# Altium schematic sheet CurrentSensor.SchDoc
size A; SheetNumber: 1; SheetTotal: 1
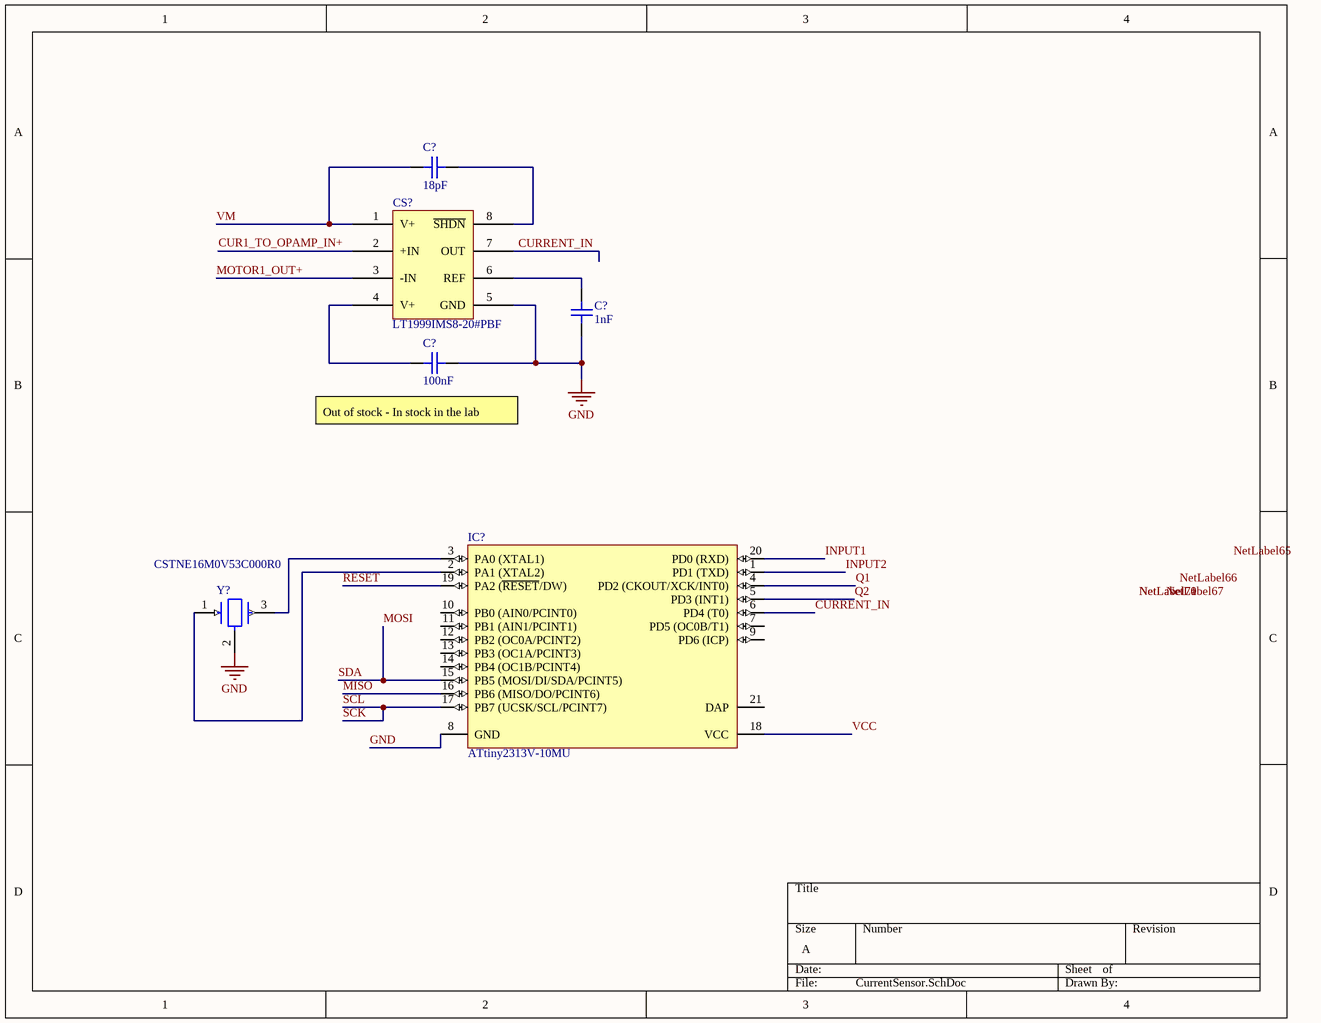
[diagram p0: CurrentSensor.SchDoc]

## Parts
(Parts that share a designator on the sheet are numbered #1, #2 ... from top to bottom, then left to right.)
C?#1  18pF  [CAP_ADJ_0805]
C?#2  1nF  [CAP_ADJ_0805]
C?#3  100nF  [CAP_ADJ_0805]
CS?  LT1999IMS8-20#PBF  [LT1999IMS8-20#PBF-ND]
IC?  ATtiny2313V-10MU  [20M1_M]
Y?  CSTNE16M0V53C000R0  [FP-CSTNE16M0V53C000R0-MFG]

## Nets
GND: C?#2.1 C?#3.1 CS?.5(GND) IC?.8(GND) Y?.2(GND)
CUR1_TO_OPAMP_IN+: CS?.2(+IN)
CURRENT_IN: CS?.7(OUT) IC?.6(PD4_(T0))
INPUT1: IC?.20(PD0_(RXD))
INPUT2: IC?.1(PD1_(TXD))
MISO: IC?.16(PB6_(MISO/DO/PCINT6))
MOSI: IC?.15(PB5_(MOSI/DI/SDA/PCINT5))  [also labelled SDA]
MOTOR1_OUT+: CS?.3(-IN)
Q1: IC?.4(PD2_(CKOUT/XCK/INT0))
Q2: IC?.5(PD3_(INT1))
RESET: IC?.19(PA2_(~{RESET}/DW))
SCK: IC?.17(PB7_(UCSK/SCL/PCINT7))  [also labelled SCL]
VCC: IC?.18(VCC)
VM: C?#1.2 CS?.1(V+)
NetC?#1_1: C?#1.1 CS?.8(~{SHDN})
NetC?#2_2: C?#2.2 CS?.6(REF)
NetC?#3_2: C?#3.2 CS?.4(V+)
NetIC?_2: IC?.2(PA1_(XTAL2)) Y?.1(Input)
NetIC?_3: IC?.3(PA0_(XTAL1)) Y?.3(Output)

Not connected (* = marked no-connect by the designer): IC? 7(PD5_(OC0B/T1)) 9(PD6_(ICP)) 10(PB0_(AIN0/PCINT0)) 11(PB1_(AIN1/PCINT1)) 12(PB2_(OC0A/PCINT2)) 13(PB3_(OC1A/PCINT3)) 14(PB4_(OC1B/PCINT4)) 21(DAP)

## Notes on the sheet
- (near C?#3) Out of stock - In stock in the lab
- Labels drawn without touching a wire or pin: NetLabel65, NetLabel66, NetLabel67

## Library data of the parts
C?#1 = CAP_ADJ_0805: CERAMIC CAPACITOR SMD 0805; Manufacturer: Yageo; Manufacturer Part Number: CC0805FRNPO9BN180; Tolerance: 1%; Voltage Rating (DC): 50V; Dielectric: C0G; Supplier 1: Digi-Key; Supplier Part Number 1: 311-4168-1-ND; Stock 1: 0; Pricing 1: 1=0.24, 10=0.172, 100=0.0808, 500=0.0566, 1000=0.0469 (USD); Mount: Surface Mount; Case/Package: 0805; Weight: 0.000194oz; Case Code (Imperial): 0805; Case Code (Metric): 2012; Min Operating Temperature: -55°C; Max Operating Temperature: 125°C; Capacitance: 18pF; Packaging: Tape and Reel; Voltage Rating: 50V; Termination: SMD/SMT; Composition: Ceramic; Length: 2mm; Height: 0.6mm; Width: 0.049inch; Thickness: 0.028inch; Depth: 1.25mm; Radiation Hardening: No; Lead Free: Lead Free; ComponentLink1URL: https://datasheet.ciiva.com/17436/upy-gp-np0-16v-to-50v-8-17436806.pdf; ComponentLink1Description: https://datasheet.ciiva.com/17436/upy-gp-np0-16v-to-50v-8-17436806.pdf; ComponentLink2URL: https://datasheet.ciiva.com/13209/upy-gp-np0-16v-to-50v-8-13209403.pdf; ComponentLink2Description: https://datasheet.ciiva.com/13209/upy-gp-np0-16v-to-50v-8-13209403.pdf; ComponentLink3URL: https://datasheet.ciiva.com/11465/upy-gp-np0-16v-to-50v-8-11465132.pdf; ComponentLink3Description: https://datasheet.ciiva.com/11465/upy-gp-np0-16v-to-50v-8-11465132.pdf
C?#2 = CAP_ADJ_0805: CERAMIC CAPACITOR SMD 0805; Manufacturer: KEMET; Manufacturer Part Number: C0805C102K4RACTU; Voltage Rating: 16V; Tolerance: 10%; Dielectric: X7R; Dissipation Factor: 5%; Supplier 1: Digi-Key; Supplier Part Number 1: 399-7987-1-ND; Stock 1: 41262; Pricing 1: 1=0.1, 10=0.07, 100=0.031, 500=0.0221, 1000=0.0174 (USD); Mount: Surface Mount; Case/Package: 0805; Case Code (Metric): 2012; Case Code (Imperial): 0805; Dielectric Material: Ceramic; Min Operating Temperature: -55°C; Max Operating Temperature: 125°C; Package Quantity: 1; Capacitance: 1nF; Packaging: Tape and Reel; Voltage Rating (DC): 16V; Termination: SMD/SMT; Length: 0.079inch; Height: 0.78mm; Width: 0.049inch; Thickness: 0.035inch; Lead Pitch: 0.75mm; REACH SVHC: No SVHC; ComponentLink1URL: http://www.mouser.com/ds/2/212/KEM_C1002_X7R_SMD-1102033.pdf; ComponentLink1Description: http://www.mouser.com/ds/2/212/KEM_C1002_X7R_SMD-1102033.pdf; ComponentLink2URL: https://search.kemet.com/component-edge/download/datasheet/C0805C102K4RACTU.pdf; ComponentLink2Description: https://search.kemet.com/component-edge/download/datasheet/C0805C102K4RACTU.pdf; ComponentLink3URL: http://capacitoredge.kemet.com/capedge2/DataSheet?pn=C0805C102K4RACTU; ComponentLink3Description: http://capacitoredge.kemet.com/capedge2/DataSheet?pn=C0805C102K4RACTU
C?#3 = CAP_ADJ_0805: CERAMIC CAPACITOR SMD 0805; Manufacturer: KEMET; Manufacturer Part Number: C0805C104J5RACAUTO; Voltage Rating: 50V; Tolerance: 5%; Dielectric: X7R; Supplier 1: Digi-Key; Supplier Part Number 1: 399-6925-1-ND; Stock 1: 9661; Pricing 1: 1=0.22, 10=0.152, 100=0.0769, 500=0.0526, 1000=0.0466 (USD); Mount: Surface Mount; Case/Package: 0805; Case Code (Metric): 2012; Case Code (Imperial): 0805; Dielectric Material: Ceramic; Min Operating Temperature: -55°C; Max Operating Temperature: 125°C; Package Quantity: 1; Capacitance: 100nF; Packaging: Cut Tape; Voltage Rating (DC): 50V; Length: 0.079inch; Width: 0.049inch; Thickness: 0.035inch; Depth: 1.25mm; REACH SVHC: No SVHC; ComponentLink1URL: http://components.arrow.com/part/dataview/0323_00324161; ComponentLink1Description: http://components.arrow.com/part/dataview/0323_00324161; ComponentLink2URL: http://www.farnell.com/datasheets/2123421.pdf; ComponentLink2Description: http://www.farnell.com/datasheets/2123421.pdf; ComponentLink3URL: https://search.kemet.com/component-edge/download/datasheet/C0805C104J5RACAUTO.pdf; ComponentLink3Description: https://search.kemet.com/component-edge/download/datasheet/C0805C104J5RACAUTO.pdf
CS? = LT1999IMS8-20#PBF: IC OPAMP CURR SENSE 2MHZ 8MSOP; Manufacturer: Analog Devices / Linear Technology; Nominal Supply Current: 5.8mA; Common Mode Rejection Ratio: 75dB; Number of Channels: 1; Max Supply Voltage: 5.5V; Min Supply Voltage: 4.5V; Operating Supply Voltage: 5V; Slew Rate: 3V/µs; Input Bias Current: 137.5uA; Input Offset Voltage (Vos): 1.5mV; Output Current per Channel: 40mA; Number of Amplifiers: 2; Power Supply Rejection Ratio (PSRR): 68dB; Voltage Gain: 26.06dB; Input Resistance: 20MR; Supplier 1: Digi-Key; Manufacturer Part Number: LT1999IMS8-20#PBF; Stock 1: 1084; Pricing 1: 1=4.69, 25=3.114, 100=2.5704 (USD); Mount: Surface Mount; Case/Package: MSOP; Number of Pins: 8; Min Operating Temperature: -40°C; Max Operating Temperature: 85°C; Bandwidth: 2MHz; Package Quantity: 50; -3db Bandwidth: 2MHz; Packaging: Rail/Tube; Number of Circuits: 1; Operating Supply Current: 5.8mA; Number of Elements: 2; Radiation Hardening: No; REACH SVHC: No SVHC; ComponentLink1URL: https://datasheet.ciiva.com/1492/1712294-1492547.pdf; ComponentLink1Description: https://datasheet.ciiva.com/1492/1712294-1492547.pdf; ComponentLink2URL: https://datasheet.ciiva.com/15129/getdatasheetpartid-480250-15129031.pdf; ComponentLink2Description: https://datasheet.ciiva.com/15129/getdatasheetpartid-480250-15129031.pdf; ComponentLink3URL: https://datasheet.ciiva.com/14152/lt1999-eng-ds-14152393.pdf; ComponentLink3Description: https://datasheet.ciiva.com/14152/lt1999-eng-ds-14152393.pdf; ComponentLink4URL: https://datasheet.ciiva.com/1794/30000-1794699.pdf; ComponentLink4Description: https://datasheet.ciiva.com/1794/30000-1794699.pdf; Supplier Part Number 1: LT1999IMS8-20#PBF-ND
IC? = CMP-0093-00093-2: Low Power tinyAVR® 8-Bit Microcontroller, 1.8-5.5V, 10MHz, 2K Flash Memory, Industrial Grade (-40°C to 85°C), 20-Lead MLF, Pb-Free; PackageReference: 20M1; ComponentLink3URL: http://www.atmel.com/dyn/resources/prod_documents/doc2543S.pdf; DatasheetVersion: revL, Aug-2010; PackageVersion: revA, Oct-2004; ComponentLink2URL: http://www.atmel.com/dyn/resources/prod_documents/doc2543.pdf; RevisionNote: DatasheetVersion updated. DAP pin added. URLs added.; Code_JEDEC: MO-220WGGD-5; ComponentLink1Description: Manufacturer URL; PackageDescription: 20-pad, 4 x 4 x 0.8 mm Body, Lead Pitch 0.50 mm, 2.6 mm Exposed Pad, Micro Lead Frame Package (MLF); ComponentLink1URL: http://www.atmel.com/; ComponentLink2Description: ATtiny2313 Datasheet; ComponentLink3Description: ATtiny2313 Summary
Y? = CMP-06057-000009-1: CERAMIC RES 16.0000MHZ 15PF SMD; Impedance: 40R; Frequency Stability: 0.15%; Frequency: 16MHz; Frequency Tolerance: 0.5%; Capacitance: 15pF; Resistor Type: Ceramic; Min Operating Temperature: -40°C; Case/Package: SMD/SMT; Packaging: Tape and Reel; Max Operating Temperature: 125°C; Mount: Surface Mount